# Altium schematic sheet PIC Processor.SchDoc
size A
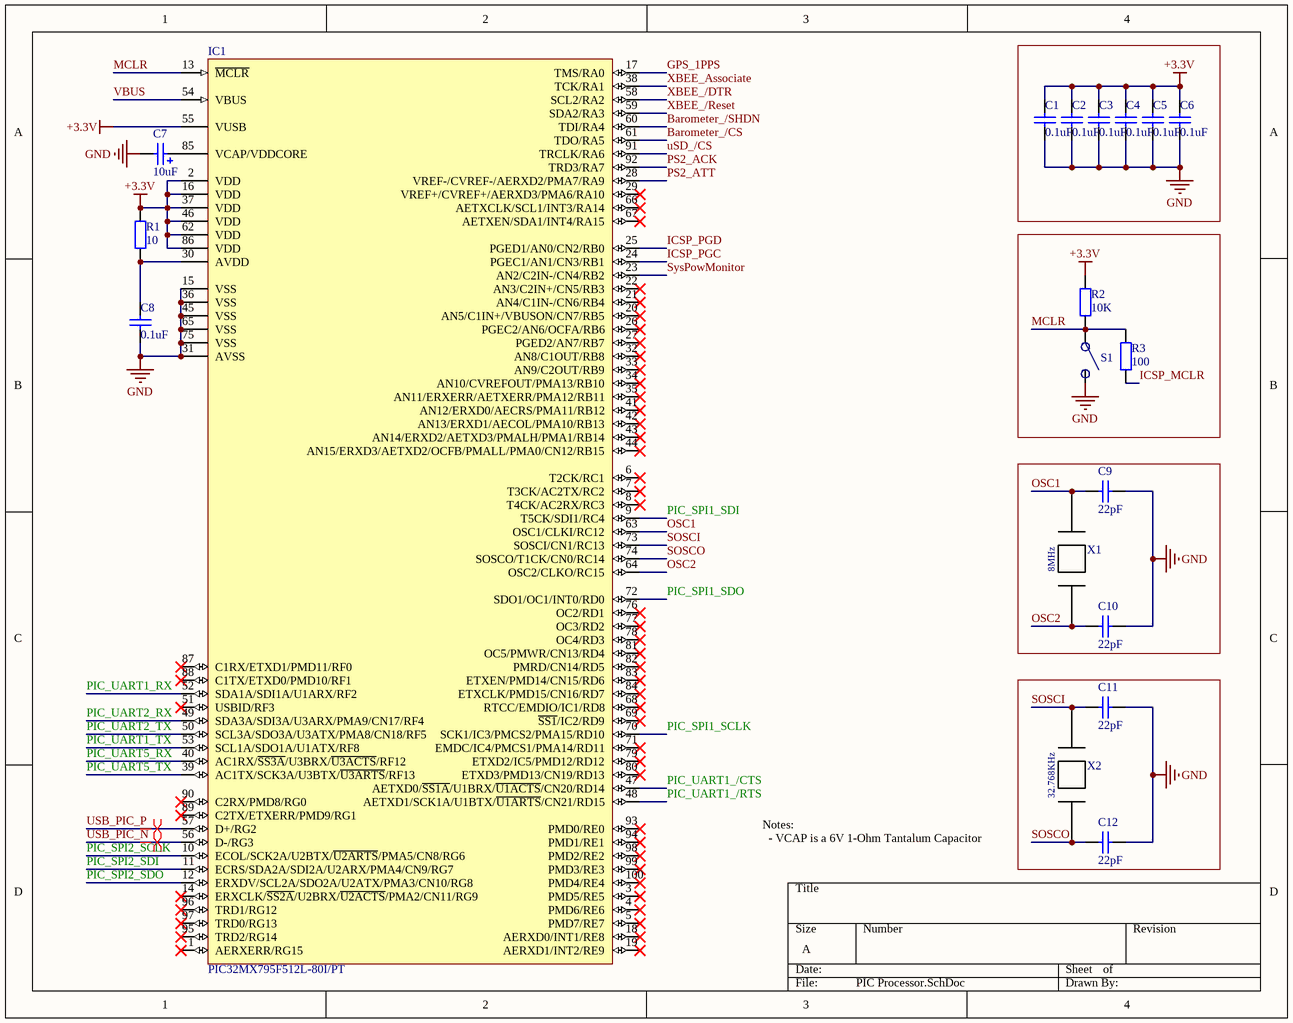
[diagram p0: PIC Processor.SchDoc]

## Parts
C1  value 0.1uF  [SMD 1206]  (hidden comment: 0.1uF SMD 1206)
C2  value 0.1uF  [SMD 1206]  (hidden comment: 0.1uF SMD 1206)
C3  value 0.1uF  [SMD 1206]  (hidden comment: 0.1uF SMD 1206)
C4  value 0.1uF  [SMD 1206]  (hidden comment: 0.1uF SMD 1206)
C5  value 0.1uF  [SMD 1206]  (hidden comment: 0.1uF SMD 1206)
C6  value 0.1uF  [SMD 1206]  (hidden comment: 0.1uF SMD 1206)
C7  value 10uF  [Capacitor - Tantalum Case A]  (hidden comment: 10uF Low-ESR Tantalum CaseA)
C8  value 0.1uF  [SMD 1206]  (hidden comment: 0.1uF SMD 1206)
C9  value 22pF  [SMD 1206]  (hidden comment: 22pF SMD 1206)
C10  value 22pF  [SMD 1206]  (hidden comment: 22pF SMD 1206)
C11  value 22pF  [SMD 1206]  (hidden comment: 22pF SMD 1206)
C12  value 22pF  [SMD 1206]  (hidden comment: 22pF SMD 1206)
IC1  PIC32MX795F512L-80I/PT  [TQFP-PF100_L]
R1  value 10  [SMD 0805]  (hidden comment: 10 SMD 0805)
R2  value 10K  [SMD 0805]  (hidden comment: 10K SMD 0805)
R3  value 100  [SMD 0805]  (hidden comment: 100 SMD 0805)
S1  Reset  [SMD Tactile Switch]  (value not drawn)
X1  XT9M20ANA8M  [XT9M20ANA8M - 8MHz Capacitor]  (value not drawn)
X2  SSP-T6-7PF-20PPM  [32.768KHz Crystal]  (value not drawn)

## Nets
+3.3V: C1.1 C2.1 C3.1 C4.1 C5.1 C6.1 IC1.2(VDD) IC1.16(VDD) IC1.37(VDD) IC1.46(VDD) IC1.55(VUSB) IC1.62(VDD) IC1.86(VDD) R1.2 R2.2
GND: C1.2 C2.2 C3.2 C4.2 C5.2 C6.2 C7.2(-) C8.2 C9.1 C10.1 C11.1 C12.1 IC1.15(VSS) IC1.31(AVSS) IC1.36(VSS) IC1.45(VSS) IC1.65(VSS) IC1.75(VSS) S1.1
Barometer_/CS: IC1.61(TDO/RA5)
Barometer_/SHDN: IC1.60(TDI/RA4)
GPS_1PPS: IC1.17(TMS/RA0)
ICSP_MCLR: R3.2
ICSP_PGC: IC1.24(PGEC1/AN1/CN3/RB1)
ICSP_PGD: IC1.25(PGED1/AN0/CN2/RB0)
MCLR: IC1.13(~{MCLR}) R2.1 R3.1 S1.2
OSC1: C9.2 IC1.63(OSC1/CLKI/RC12) X1.1
OSC2: C10.2 IC1.64(OSC2/CLKO/RC15) X1.0
PIC_SPI1_SCLK: IC1.70(SCK1/IC3/PMCS2/PMA15/RD10)
PIC_SPI1_SDI: IC1.9(T5CK/SDI1/RC4)
PIC_SPI1_SDO: IC1.72(SDO1/OC1/INT0/RD0)
PIC_SPI2_SCLK: IC1.10(ECOL/SCK2A/U2BTX/~{U2ARTS}/PMA5/CN8/RG6)
PIC_SPI2_SDI: IC1.11(ECRS/SDA2A/SDI2A/U2ARX/PMA4/CN9/RG7)
PIC_SPI2_SDO: IC1.12(ERXDV/SCL2A/SDO2A/U2ATX/PMA3/CN10/RG8)
PIC_UART1_/CTS: IC1.47(AETXD0/~{SS1A}/U1BRX/~{U1ACTS}/CN20/RD14)
PIC_UART1_/RTS: IC1.48(AETXD1/SCK1A/U1BTX/~{U1ARTS}/CN21/RD15)
PIC_UART1_RX: IC1.52(SDA1A/SDI1A/U1ARX/RF2)
PIC_UART1_TX: IC1.53(SCL1A/SDO1A/U1ATX/RF8)
PIC_UART2_RX: IC1.49(SDA3A/SDI3A/U3ARX/PMA9/CN17/RF4)
PIC_UART2_TX: IC1.50(SCL3A/SDO3A/U3ATX/PMA8/CN18/RF5)
PIC_UART5_RX: IC1.40(AC1RX/~{SS3A}/U3BRX/~{U3ACTS}/RF12)
PIC_UART5_TX: IC1.39(AC1TX/SCK3A/U3BTX/~{U3ARTS}/RF13)
PS2_ACK: IC1.92(TRD3/RA7)
PS2_ATT: IC1.28(VREF-/CVREF-/AERXD2/PMA7/RA9)
SOSCI: C11.2 IC1.73(SOSCI/CN1/RC13) X2.0
SOSCO: C12.2 IC1.74(SOSCO/T1CK/CN0/RC14) X2.1
SysPowMonitor: IC1.23(AN2/C2IN-/CN4/RB2)
USB_PIC_N: IC1.56(D-/RG3)
USB_PIC_P: IC1.57(D+/RG2)
uSD_/CS: IC1.91(TRCLK/RA6)
VBUS: IC1.54(VBUS)
XBEE_/DTR: IC1.58(SCL2/RA2)
XBEE_/Reset: IC1.59(SDA2/RA3)
XBEE_Associate: IC1.38(TCK/RA1)
NetC7_1: C7.1(+) IC1.85(VCAP/VDDCORE)
NetC8_1: C8.1 IC1.30(AVDD) R1.1

Not connected (* = marked no-connect by the designer): IC1 1(AERXERR/RG15)* 3(PMD5/RE5)* 4(PMD6/RE6)* 5(PMD7/RE7)* 6(T2CK/RC1)* 7(T3CK/AC2TX/RC2)* 8(T4CK/AC2RX/RC3)* 14(ERXCLK/~{SS2A}/U2BRX/~{U2ACTS}/PMA2/CN11/RG9)* 18(AERXD0/INT1/RE8)* 19(AERXD1/INT2/RE9)* 20(AN5/C1IN+/VBUSON/CN7/RB5)* 21(AN4/C1IN-/CN6/RB4)* 22(AN3/C2IN+/CN5/RB3)* 26(PGEC2/AN6/OCFA/RB6)* 27(PGED2/AN7/RB7)* 29(VREF+/CVREF+/AERXD3/PMA6/RA10)* 32(AN8/C1OUT/RB8)* 33(AN9/C2OUT/RB9)* 34(AN10/CVREFOUT/PMA13/RB10)* 35(AN11/ERXERR/AETXERR/PMA12/RB11)* 41(AN12/ERXD0/AECRS/PMA11/RB12)* 42(AN13/ERXD1/AECOL/PMA10/RB13)* 43(AN14/ERXD2/AETXD3/PMALH/PMA1/RB14)* 44(AN15/ERXD3/AETXD2/OCFB/PMALL/PMA0/CN12/RB15)* 51(USBID/RF3)* 66(AETXCLK/SCL1/INT3/RA14)* 67(AETXEN/SDA1/INT4/RA15)* 68(RTCC/EMDIO/IC1/RD8)* 69(~{SS1}/IC2/RD9)* 71(EMDC/IC4/PMCS1/PMA14/RD11)* 76(OC2/RD1)* 77(OC3/RD2)* 78(OC4/RD3)* 79(ETXD2/IC5/PMD12/RD12)* 80(ETXD3/PMD13/CN19/RD13)* 81(OC5/PMWR/CN13/RD4)* 82(PMRD/CN14/RD5)* 83(ETXEN/PMD14/CN15/RD6)* 84(ETXCLK/PMD15/CN16/RD7)* 87(C1RX/ETXD1/PMD11/RF0)* 88(C1TX/ETXD0/PMD10/RF1)* 89(C2TX/ETXERR/PMD9/RG1)* 90(C2RX/PMD8/RG0)* 93(PMD0/RE0)* 94(PMD1/RE1)* 95(TRD2/RG14)* 96(TRD1/RG12)* 97(TRD0/RG13)* 98(PMD2/RE2)* 99(PMD3/RE3)* 100(PMD4/RE4)*

## Layout directives
differential pair: USB_PIC_N, USB_PIC_P

## Notes on the sheet
- Notes:
  - VCAP is a 6V 1-Ohm Tantalum Capacitor
- (in symbol SSP-T6-7PF-20PPM) 32.768KHz
- (in symbol XT9M20ANA8M) 8MHz

## Library data of the parts
C1-C6 C8-C12 = Cap: Capacitor
C7 = SMD_Cap_Tantalum: Tantalum Capacitor - Case A
IC1 = PIC32MX795F512L-80I/PT: High Performance 80 MHz MIPS-Based 32-Bit Flash Microcontroller with USB, CAN and Ethernet, 512KB Program Memory, 100-pin TQFP, Industrial Temperature; Published: 2-Dec-2009; DatasheetVersion: revB, Nov-2009; PackageVersion: revBB, Aug-2009; PackageReference: TQFP-PT100; Publisher: Altium Limited; PackageDescription: 100-Lead Plastic Thin Quad Flatpack (PT) - 12x12x1mm Body, 2.00mm [TQFP]; Supplier 1: Digi-Key; Supplier Part Number 1: PIC32MX795F512L-80I/PT-ND; Supplier 2: Farnell; Supplier Part Number 2: 1778492; ComponentLink1Description: Datasheet; ComponentLink1URL: http://ww1.microchip.com/downloads/en/DeviceDoc/DS-61156B.pdf; ComponentLink2Description: Packaging Specification; ComponentLink2URL: http://ww1.microchip.com/downloads/en/PackagingSpec/en012702.pdf; ComponentLink3Description: Microchip.com Home; ComponentLink3URL: http://www.microchip.com/
R1-R3 = Res2: Resistor
S1 = SMD Tactile Switch
X1 = XT9M20ANA8M: 8MHz SMD Crystal; pin to pad: 0>1 1>2
X2 = SSP-T6-7PF-20PPM: 32.768KHz 7pF SMD Crystal; pin to pad: 0>1 1>2